# EAGLE design p0b-002 (EAGLE 9.6.2)
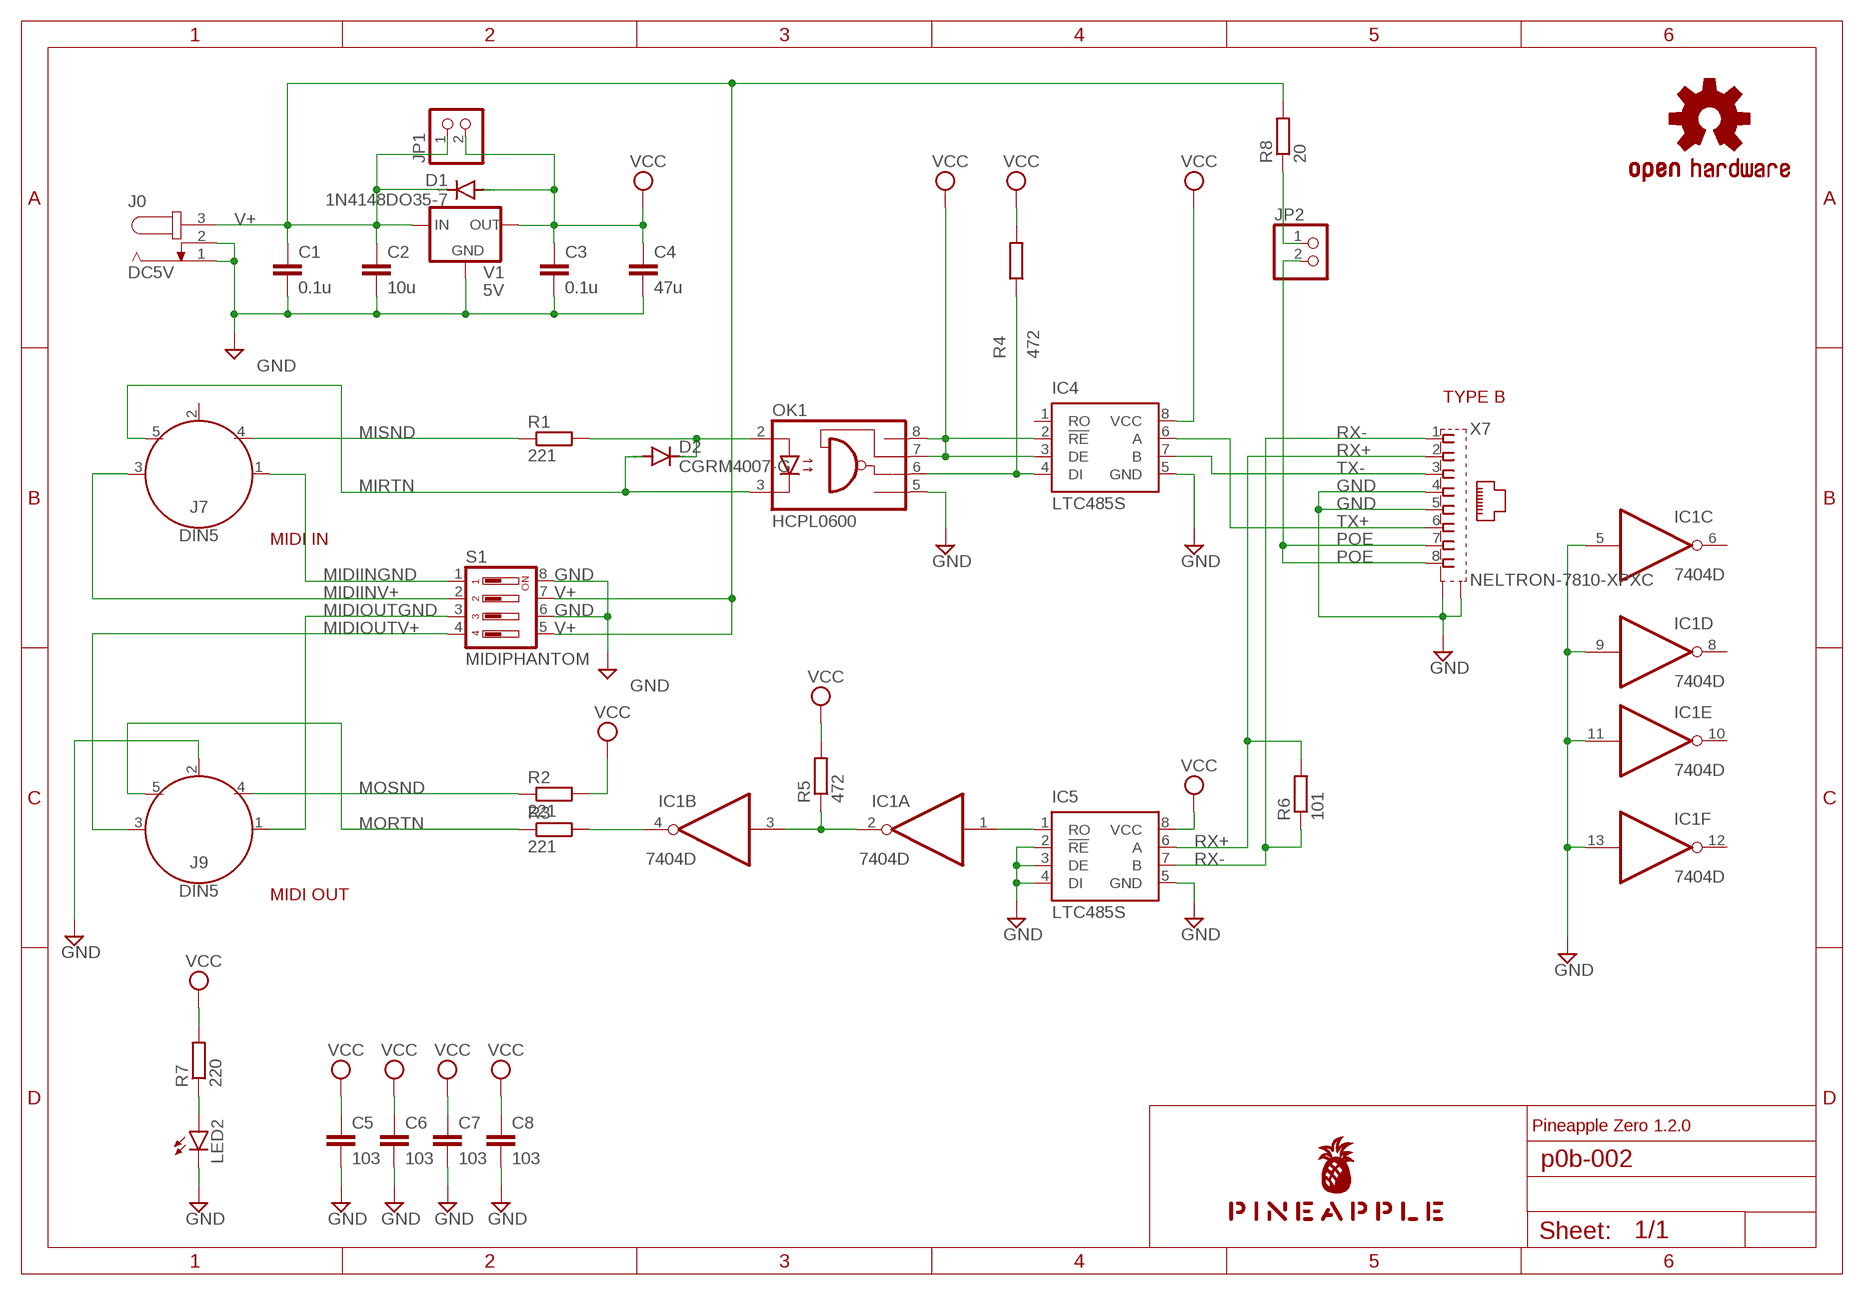
[diagram p0: schematic, sheet 1]

## Parts
C1  0.1u  C-EU025-025X050  [C025-025X050]
C2  10u  C-EU025-030X050  [C025-030X050]
C3  0.1u  C-EU025-025X050  [C025-025X050]
C4  47u  C-EU025-050X050  [C025-050X050]
C5  103  C-EUC1206  [C1206]
C6  103  C-EUC1206  [C1206]
C7  103  C-EUC1206  [C1206]
C8  103  C-EUC1206  [C1206]
D1  1N4148DO35-7  [DO35-7]
D2  CGRM4007-G  [SOD-123_MINI-SMA]
IC1  7404D  [SO14]
IC4  LTC485S  [SOIC8]
IC5  LTC485S  [SOIC8]
J0  DC5V  JACK-PLUG0  [SPC4077]
J7  DIN5  [DIN5-RA-PTH]
J9  DIN5  [DIN5-RA-PTH]
JP1  PINHD-1X2  [1X02]
JP2  PINHD-1X2  [1X02]
LED2  LEDCHIPLED_1206  [CHIPLED_1206]
LOGO1  OSHW-LOGOS-COPPER  [OSHW-LOGO-S_COPPER]
OK1  HCPL0600  [SOIC08]
R1  221  R-EU_M2012  [M2012]
R2  221  R-EU_M2012  [M2012]
R3  221  R-EU_M2012  [M2012]
R4  472  R-EU_M2012  [M2012]
R5  472  R-EU_M2012  [M2012]
R6  101  R-EU_M2012  [M2012]
R7  220  R-EU_M2012  [M2012]
R8  20  R-EU_M2012  [M2012]
S1  MIDIPHANTOM  DIP04YL  [DIP04YL]
U$1  PINEAPPLE450  [PINEAPPLE450]
V1  5V  78XXS  [78XXS]
X7  NELTRON-7810-XPXC  [NELTRON-7810-XPXC-FOOTPRINT]

## Nets
GND [gnd]: C1.2 C2.2 C3.2 C4.2 C5.2 C6.2 C7.2 C8.2 IC1.5(C:I) IC1.9(D:I) IC1.11(E:I) IC1.13(F:I) IC4.5(GND) IC5.2(!RE) IC5.3(DE) IC5.4(DI) IC5.5(GND) J0.1 J0.2 J9.2 LED2.C OK1.5(GND) S1.6 S1.8 V1.GND X7.4 X7.5 X7.S1 X7.S2
MIDIIN: D2.C OK1.2(A) R1.2
MIDIINGND [gnd]: J7.1 S1.1
MIDIINV+ [pwr]: J7.3 S1.2
MIDIOUT: IC1.4(B:O) R3.2
MIDIOUTGND [gnd]: J9.1 S1.3
MIDIOUTV+ [pwr]: J9.3 S1.4
MIRTN: D2.A J7.5 OK1.3(C)
MISND: J7.4 R1.1
MORTN: J9.5 R3.1
MOSND: J9.4 R2.1
N$4: LED2.A R7.1
NMIDIOUT: IC1.2(A:O) IC1.3(B:I) R5.1
POE [pwr]: JP2.2 X7.7 X7.8
POERAW [pwr]: JP2.1 R8.1
RX: IC1.1(A:I) IC5.1(RO)
RX+: IC5.6(A) R6.2 X7.2
RX-: IC5.7(B) R6.1 X7.1
TX: IC4.4(DI) OK1.6(VO) R4.1
TX+: IC4.6(A) X7.6
TX-: IC4.7(B) X7.3
V+ [pwr]: C1.1 C2.1 D1.C J0.3 JP1.1 R8.2 S1.5 S1.7 V1.IN
VCC [pwr]: C3.1 C4.1 C5.1 C6.1 C7.1 C8.1 D1.A IC4.2(!RE) IC4.3(DE) IC4.8(VCC) IC5.8(VCC) JP1.2 OK1.7(VE) OK1.8(VCC) R2.2 R4.2 R5.2 R7.2 V1.OUT
Unconnected: IC1.6(C:O) IC1.8(D:O) IC1.10(E:O) IC1.12(F:O) IC4.1(RO) J7.2

## Notes on the sheet
- TYPE B
- MIDI IN
- MIDI OUT
- Pineapple Zero 1.2.0

## Power pins joined to a net without a drawn wire
GND: IC1.7(P:GND)
VCC: IC1.14(P:VCC)

## Library data of the parts
C1-C8 = rcl:C-EU: CAPACITOR, European symbol; SPICEPREFIX: C
D1 = diode:1N4148: DIODE high speed (Philips)
D2 = diode:CGRM400*-G: Molded plasitc,JEDEC SOD-123/Mini SMA Source: Comchip CGRM4001-G.pdf
IC1 = 74xx-us:74*04: Hex INVERTER
IC4 IC5 = linear-technology:LTC485: Low Power RS485 Interface Transceiver Source: http://www.linear.com/pc/downloadDocument.do?navId=H0,C1,C1007,C1017,P2064,D1718; OC_FARNELL: unknown; OC_NEWARK: unknown
J0 = con-jack:JACK-PLUG: DC POWER JACK Power Jack, DC, Right Angle, Through Hole, Rated 5A at 16VDC, PC Terminals Distributor: Farnell (www.Farnell.de) Drawing: 84N1161.pdf / 84N1162.pdf Manufacturer: SPC Technology (www.spctechnology.com) Type: SPC4077 / SPC 4078; OC_FARNELL: unknown; OC_NEWARK: unknown
J7 J9 = SparkFun-Connectors:DIN5: DIN5 Connector - Female Right Angle (frequently used as a MIDI Jack connector) This type of connector and cable is frequently used for transmitting midi data (musical instrument digital interface). It is what you usually see on a keyboard or set of electronic drums. Learn more here <https://en.wikipedia.org/wiki/MIDI>. For more information on the pinout and electrical specifications of MIDI communications, please see the following resource: https://www.midi.org/specifications/item/midi-din-electrical-specification Here is the connector we sell at SparkFun: MIDI Connector - Female Right Angle <https://www.sparkfun.com/products/9536> (PRT-09536) Datasheet <hhttp://www.sparkfun.com/datasheets/Prototyping/Connectors/MIDI-RA.pdf> It is used on this SparkFun product: SparkFun MIDI Shield <https://www.sparkfun.com/products/12898> (DEV-12898); PROD_ID: CONN-09481
JP1 JP2 = pinhead:PINHD-1X2: PIN HEADER
LED2 = led:LED: LED OSRAM: - CHIPLED LG R971, LG N971, LY N971, LG Q971, LY Q971, LO R971, LY R971 LH N974, LH R974 LS Q976, LO Q976, LY Q976 LO Q996 - Hyper CHIPLED LW Q18S LB Q993, LB Q99A, LB R99A - SideLED LS A670, LO A670, LY A670, LG A670, LP A670 LB A673, LV A673, LT A673, LW A673 LH A674 LY A675 LS A676, LA A676, LO A676, LY A676, LW A676 LS A679, LY A679, LG A679 - Hyper Micro SIDELED® LS Y876, LA Y876, LO Y876, LY Y876 LT Y87S - SmartLED LW L88C, LW L88S LB L89C, LB L89S, LG L890 LS L89K, LO L89K, LY L89K LS L896, LA L896, LO L896, LY L896 - TOPLED LS T670, LO T670, LY T670, LG T670, LP T670 LSG T670, LSP T670, LSY T670, LOP T670, LYG T670 LG T671, LOG T671, LSG T671 LB T673, LV T673, LT T673, LW T673 LH T674 LS T676, LA T676, LO T676, LY T676, LB T676, LH T676, LSB T676, LW T676 LB T67C, LV T67C, LT T67C, LS T67K, LO T67K, LY T67K, LW E67C LS E67B, LA E67B, LO E67B, LY E67B, LB E67C, LV E67C, LT E67C LW T67C LS T679, LY T679, LG T679 LS T770, LO T770, LY T770, LG T770, LP T770 LB T773, LV T773, LT T773, LW T773 LH T774 LS E675, LA E675, LY E675, LS T675 LS T776, LA T776, LO T776, LY T776, LB T776 LHGB T686 LT T68C, LB T68C - Hyper Mini TOPLED® LB M676 - Mini TOPLED Santana® LG M470 LS M47K, LO M47K, LY M47K Source: http://www.osram.convergy.de LUXEON: - LUMILED® LXK2-PW12-R00, LXK2-PW12-S00, LXK2-PW14-U00, LXK2-PW14-V00 LXK2-PM12-R00, LXK2-PM12-S00, LXK2-PM14-U00 LXK2-PE12-Q00, LXK2-PE12-R00, LXK2-PE12-S00, LXK2-PE14-T00, LXK2-PE14-U00 LXK2-PB12-K00, LXK2-PB12-L00, LXK2-PB12-M00, LXK2-PB14-N00, LXK2-PB14-P00, LXK2-PB14-Q00 LXK2-PR12-L00, LXK2-PR12-M00, LXK2-PR14-Q00, LXK2-PR14-R00 LXK2-PD12-Q00, LXK2-PD12-R00, LXK2-PD12-S00 LXK2-PH12-R00, LXK2-PH12-S00 LXK2-PL12-P00, LXK2-PL12-Q00, LXK2-PL12-R00 Source: www.luxeon.com KINGBRIGHT: KA-3528ASYC Source: www.kingbright.com
LOGO1 = SparkFun-Aesthetics:OSHW-LOGO: Open-Source Hardware (OSHW) Logo This logo indicates the piece of hardware it is found on incorporates a OSHW license and/or adheres to the definition of open source hardware found here: http://freedomdefined.org/OSHW
OK1 = optocoupler:HCPL0600: HEWLETT PACKARD OPTO COUPLER; MF: AGILENT TECHNOLOGIES; MPN: HCPL-0600-000E; OC_FARNELL: 9994696; OC_NEWARK: 88H7774
R1-R8 = rcl:R-EU_: RESISTOR, European symbol; SPICEPREFIX: R
S1 = switch-dil:DIP04YL: DIL/CODE SWITCH; OC_FARNELL: unknown; OC_NEWARK: unknown
U$1 = pineapple:PINEAPPLE450
V1 = v-reg:78XXS: VOLTAGE REGULATOR
X7 = con-rj45:NELTRON-7810-XPXC: Mod. Jack, Right Angle, 8 posiotion, 8 contatcs RJ45 Source: GLX-S-88M.pdf

## Net classes
0 default: width 0.152 mm, drill 0.152 mm, clearance 0.152 mm
1 pwr: width 0.305 mm, drill 0.152 mm, clearance 0.152 mm
2 gnd: width 0.305 mm, drill 0.152 mm, clearance 0.152 mm

## Board
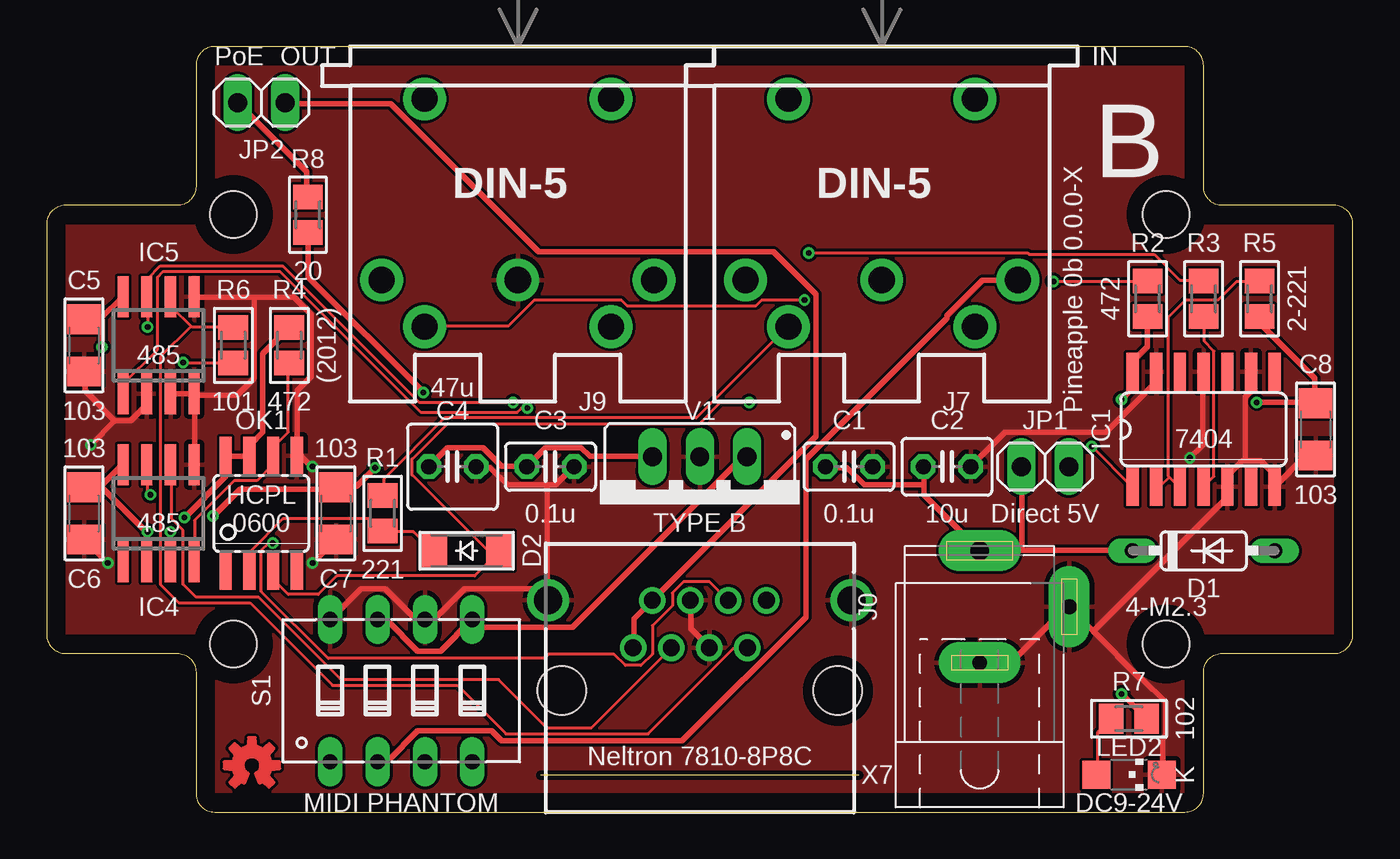
[diagram p1: board, top side]
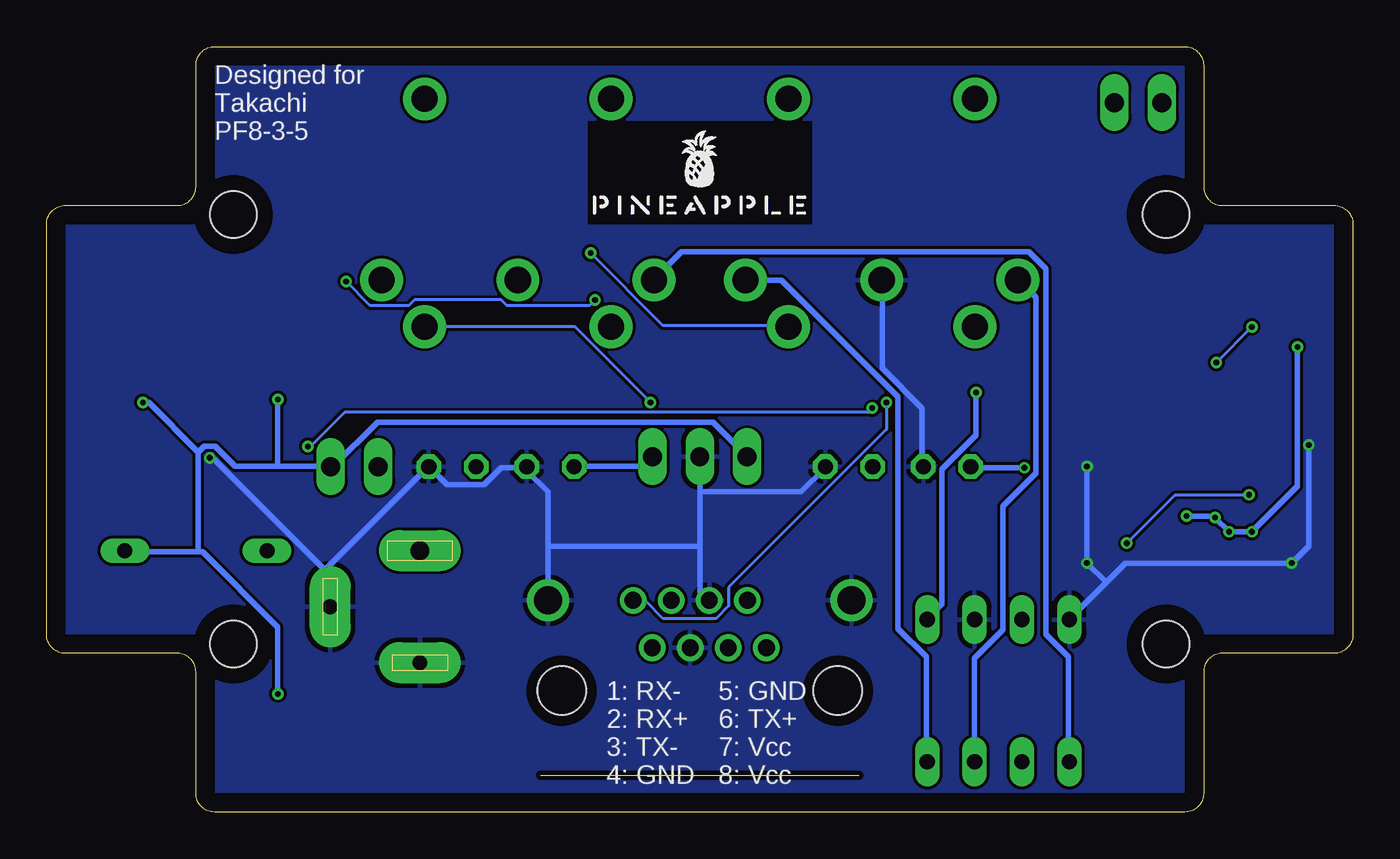
[diagram p2: board, bottom side, seen from below]

Size 70 x 41 mm. Coordinates in mm from the lower left corner, seen from the top.
Outline: 1,8.5 7,8.5 arc-90 8,7.5 8,1 arc90 9,0 61,0 arc90 62,1 62,7.5 arc-90 63,8.5 69,8.5 arc90 70,9.5 70,31.5 arc90 69,32.5 63,32.5 arc-90 62,33.5 62,40 arc90 61,41 9,41 arc90 8,40 8,33.5 arc-90 7,32.5 1,32.5 arc90 0,31.5 0,9.5 arc90 1,8.5
Copper layers (1*16): Top 0.035mm / dielectric 1.5mm / Bottom 0.035mm
Design rules "SeeedStudio_2layer_DRU_no_angle_20140221": minimum track width 6mil, minimum drill 12mil, track to track 6mil, track to pad 6mil, pad to pad 6mil, via to via 6mil, smd to smd 0mil, copper to edge 10mil, drill to drill 10mil, minimum pad ring 10mil, minimum via ring 6mil, stop-mask expansion 2mil, vias tented up to drill 100mil, thermal gap 10mil
Holes 2.5 mm at 10,9 60,9 60,32 10,32
tRestrict: area 0,8.5 to 1,32.5; area 0,31.5 to 9,32.5; area 8,31.5 to 9,41; area 8,40 to 62,41; area 61,31.5 to 62,41; area 61,31.5 to 70,32.5; area 69,8.5 to 70,32.5; area 61,8.5 to 70,9.5; area 61,0 to 62,9.5; area 8,0 to 62,1; area 8,0 to 9,9.5; area 0,8.5 to 9,9.5; 4 more areas
bRestrict: area 8,40 to 62,41; area 69,8.5 to 70,32.5; area 8,0 to 62,1; area 0,8.5 to 1,32.5; area 8,7 to 12,11; area 8,31.5 to 9,41; area 61,31.5 to 62,41; area 8,0 to 9,9.5; area 61,0 to 62,9.5; area 0,31.5 to 9,32.5; area 0,8.5 to 9,9.5; area 61,8.5 to 70,9.5; 5 more areas

### Footprints (pad centres in the part's own frame; a part is rotated, then mirrored left to right if it is on the bottom)
C025-025X050 = drill 0.813 octagon: 1 -1.27,0; 2 1.27,0
C025-030X050 = drill 0.813 octagon: 1 -1.27,0; 2 1.27,0
C025-050X050 = drill 0.813 octagon: 1 -1.27,0; 2 1.27,0
C1206 = smd 1.6 x 1.8: 1 -1.4,0; 2 1.4,0
DO35-7 = drill 0.813 long: A 3.81,0; C -3.81,0
SOD-123_MINI-SMA = smd 1.5 x 2.1: A 1.8,0; C -1.8,0
SO14 = smd 0.66 x 2.032: 1 -3.81,-3.073; 2 -2.54,-3.073; 3 -1.27,-3.073; 4 0,-3.073; 5 1.27,-3.073; 6 2.54,-3.073; 7 3.81,-3.073; 8 3.81,3.073; 9 2.54,3.073; 10 1.27,3.073; 11 0,3.073; 12 -1.27,3.073; 13 -2.54,3.073; 14 -3.81,3.073
SOIC8 = smd 0.6 x 2.2: 1 -1.905,-2.6; 2 -0.635,-2.6; 3 0.635,-2.6; 4 1.905,-2.6; 5 1.905,2.6; 6 0.635,2.6; 7 -0.635,2.6; 8 -1.905,2.6
SPC4077 = drill 0.8 pad 2.184 long: 1 -3,0; 2 0,-4.8 | drill 1 pad 2.184 long: 3 3,0
DIN5-RA-PTH = drill 1.4 pad 2.286: 1 7.3,12.5; 2 0,12.5; 3 -7.3,12.5; 4 5,15; 5 -5,15; 6 -5,2.8; 7 5,2.8
1X02 = drill 1.016 long: 1 -1.27,0; 2 1.27,0
CHIPLED_1206 = smd 1.5 x 1.5: A 0,-1.75; C 0,1.75
SOIC08 = smd 0.66 x 2.032: 1 -1.905,-3.073; 2 -0.635,-3.073; 3 0.635,-3.073; 4 1.905,-3.073; 5 1.905,3.073; 6 0.635,3.073; 7 -0.635,3.073; 8 -1.905,3.073
M2012 = smd 1.3 x 1.6: 1 -0.95,0; 2 0.95,0
DIP04YL = drill 0.813 long: 1 -3.81,-3.81; 2 -1.27,-3.81; 3 1.27,-3.81; 4 3.81,-3.81; 5 3.81,3.81; 6 1.27,3.81; 7 -1.27,3.81; 8 -3.81,3.81
78XXS = drill 1.016 long: GND 0,-2.54; IN -2.54,-2.54; OUT 2.54,-2.54
NELTRON-7810-XPXC-FOOTPRINT = drill 0.9 pad 1.422: 1 -3.57,-4.84; 2 -2.55,-2.3; 3 -1.53,-4.84; 4 -0.51,-2.3; 5 0.51,-4.84; 6 1.53,-2.3; 7 2.55,-4.84; 8 3.57,-2.3 | drill 1.5 pad 2.184: S1 -8.125,-4.84; S2 8.125,-4.84 | hole 2.6: -7.4,0; 7.4,0

### Placement (x,y rotation side)
C1  43,18.5 0 top
C2  48.25,18.5 0 top
C3  27,18.5 0 top
C4  21.75,18.5 0 top
C5  2,25 270 top
C6  2,16 270 top
C7  15.5,16 270 top
C8  68,20.5 270 top
D1  62,14 0 top
D2  22.5,14 0 top
IC1  62,20.5 0 top
IC4  6,16 0 top
IC5  6,25 0 top
J0  50,11 90 top
J7  44.75,41 180 top
J9  25.25,41 180 top
JP1  53.5,18.5 0 top
JP2  11.5,38 0 top
LED2  58,2 270 top
LOGO1  11,2.5 0 top
OK1  11.5,16 0 top
R1  18,16 270 top
R2  59,27.5 270 top
R3  62,27.5 270 top
R4  13,25 90 top
R5  65,27.5 270 top
R6  10,25 90 top
R7  58,5 0 top
R8  14,32 270 top
S1  19,6.5 0 top
U$1  35,32 0 bottom
V1  35,16.5 180 top
X7  35,6.5 180 top

### Tracks (layer width: path | path; a pad name or v marks a point on that pad's centre or on a via)
GND  (via drill 0.3)
  Top 0.305: C8.2 67.97,19.05 67.44,19.05 65.84,17.45 IC1.7 66.06,17.83 65.08,18.82 64.24,18.82 | 64.24,18.82 64.08,18.82 63.32,18.06 63.32,17.45 IC1.5 63.25,17.3 63.25,16.84 56.08,9.68 | 64.24,18.82 64.24,22.25 64.47,22.48 64.47,23.55 IC1.9 | 56.08,9.68 54.79,10.97 J0.2 54.63,10.97 51.66,8 50.06,8 J0.1 | 56.08,9.68 58.6,7.16 58.67,7.16 59.97,5.87 59.97,4.12 59.82,3.96 59.82,2.06 LED2.C | v61.27,18.97 61.95,19.66 61.95,23.55 IC1.11 | IC4.5 7.92,18.67 7.92,22.33 IC5.4 | IC5.3 6.71,22.4 7.77,22.4 IC5.4 | 11.12,27.58 7.92,27.58 IC5.5 | 11.12,27.58 13.26,27.58 14.17,26.67 14.17,23.32 13.41,22.55 13.41,19.13 OK1.5 13.56,19.13 14.17,18.52 v14.25,18.52 | 11.12,27.58 11.12,23.24 10.21,22.33 8.08,22.33 IC5.4 | 3.66,20.95 2.06,22.55 2.06,23.55 C5.2 | 3.66,20.95 4.5,20.95 5.33,21.79 5.33,22.33 IC5.2 | v3.28,13.34 2.06,14.55 C6.2 | v14.25,13.34 15.47,14.55 C7.2 | S1.8 15.24,10.36 16.84,11.96 18.14,11.96 19.74,10.36 20.27,10.36 S1.6 20.42,10.36 20.8,10.36 22.4,11.96 26.75,11.96 X7.S2 26.82,11.35 26.82,17.53 | v2.36,19.66 3.66,20.95 | IC1.13 59.44,23.55 59.44,23.01 56.77,20.34 51.36,20.34 49.53,18.52 C2.2 | X7.5 34.52,11.28 34.52,9.83 35.51,8.84 X7.4 | 26.82,17.53 27.28,17.53 28.19,18.44 C3.2 | 26.82,17.53 24.69,17.53 23.77,18.44 23.09,18.44 C4.2
  Bottom 0.305: v61.27,18.97 61.11,18.97 54.86,12.72 54.86,11.05 J0.2 55.02,13.03 49.61,18.44 C2.2 49.45,18.44 48.54,17.53 46.56,17.53 45.64,18.44 44.27,18.44 C1.2 44.27,18.29 43.13,17.14 43.13,14.25 | 13.22,12.31 15.16,10.36 S1.8 | 13.22,12.31 12.19,13.34 v3.28,13.34 2.36,14.25 v2.36,19.66 | 13.22,12.31 v14.25,13.34 v14.25,18.52 | 43.13,14.25 43.13,11.35 X7.S1 | 34.98,14.25 34.98,11.81 34.52,11.35 X7.5 | 34.98,14.25 34.98,17.14 | 34.98,17.14 34.98,18.97 V1.GND | J9.2 25.22,28.5 25.22,23.77 23.09,21.64 23.09,18.52 C4.2 | 34.98,17.14 29.57,17.14 28.27,18.44 C3.2 | 34.98,14.25 43.13,14.25
  pour Top: -2,-2 72,-2 72,42 -2,42
  pour Bottom: -4,-4 74,-4 74,44 -4,44
MIDIIN
  Top 0.152: D2.C 20.65,14.02 19.66,15.01 18.06,15.01 R1.2 17.98,15.09 17.37,15.7 12.65,15.7 10.9,13.95 10.9,12.95 OK1.2
MIDIINGND
  Bottom 0.305: S1.1 15.24,2.74 15.24,8.31 16.46,9.53 16.46,29.11 17.37,30.02 35.97,30.02 37.41,28.57 J7.1
MIDIINV+
  Top 0.305: S1.2 17.75,2.74 18.29,2.74 19.89,4.34 23.85,4.34 24.38,3.81 34.06,3.81 40.69,10.44 40.69,18.9 48.23,26.44 48.23,26.59 50.14,28.5 J7.3
MIDIOUT
  Top 0.152: R3.2 62.03,26.52 62.03,25.22 62.56,24.69 62.56,17.98 62.03,17.45 IC1.4
MIDIOUTGND
  Bottom 0.305: S1.3 20.27,2.74 20.27,8.23 18.75,9.75 18.75,16.38 16.99,18.14 16.99,27.58 17.91,28.5 J9.1
MIDIOUTV+
  Bottom 0.305: S1.4 22.86,2.74 22.86,8.31 24.38,9.83 24.38,22.25 30.63,28.5 32.54,28.5 J9.3
MIRTN  (via drill 0.3)
  Top 0.152: OK1.3 12.19,12.88 12.19,12.42 12.95,11.66 14.55,11.66 15.54,12.65 22.94,12.65 24.23,13.95 D2.A 23.93,13.72 19.58,18.06 19.58,18.9 21.49,20.8 34.98,20.8 36.12,21.95 v37.64,21.95
  Bottom 0.152: v37.64,21.95 41.68,25.98 49.68,25.98 J7.5
MISND
  Top 0.152: R1.1 18.06,16.99 18.06,17.83 21.34,21.11 34.82,21.11 39.7,25.98 J7.4
MORTN  (via drill 0.3)
  Top 0.152: v40.84,29.95 52.58,29.95 52.65,29.87 59.36,29.87 60.73,28.5 61.95,28.5 R3.1
  Bottom 0.152: v40.84,29.95 36.96,26.06 30.25,26.06 J9.5
MOSND  (via drill 0.3)
  Top 0.152: v53.95,28.42 58.98,28.42 R2.1 | v40.62,27.43 38.33,27.43 38.02,27.13 31.09,27.13 30.79,27.43 26.14,27.43 24.77,26.06 20.27,26.06 J9.4
  Bottom 0.152: v53.95,28.42 52.65,27.13 50.6,27.13 50.29,27.43 45.64,27.43 45.34,27.13 40.92,27.13 v40.62,27.43
N$4
  Top 0.152: LED2.A 56.31,2.06 56.31,4.27 57,4.95 R7.1
NMIDIOUT
  Top 0.152: 60.16,17.95 60.66,17.45 IC1.3 | 60.16,17.95 60.12,17.98 60.12,26.52 61.04,27.43 62.79,27.43 63.78,28.42 65,28.42 R5.1 | 60.16,17.95 59.66,17.45 59.51,17.45 IC1.2
POE
  Top 0.305: X7.8 31.47,8.84 31.47,10.36 32.38,11.28 X7.7 32.54,11.43 41.22,20.12 41.22,27.74 38.94,30.02 26.36,30.02 18.44,37.95 12.8,37.95 JP2.2
POERAW
  Top 0.305: R8.1 13.95,32.99 13.95,34.29 10.29,37.95 JP2.1
RX  (via drill 0.3)
  Top 0.152: v56.01,19.58 58.14,17.45 IC1.1 | v25.76,21.64 25.45,21.64 25.22,21.41 20.04,21.41 12.5,28.96 6.25,28.96 5.94,28.65 5.94,24.77 4.12,22.94 4.12,22.4 IC5.1
  Bottom 0.152: v56.01,19.58 55.85,19.58 54.03,21.41 25.98,21.41 v25.76,21.64
RX+
  Top 0.152: 7.73,26.02 6.71,27.05 6.71,27.58 IC5.6 | 7.73,26.02 7.77,25.98 9.98,25.98 R6.2 | 7.73,26.02 6.1,24.38 6.1,12.19 7.09,11.2 10.9,11.2 15.32,6.78 22.02,6.78 24.61,4.19 32.23,4.19 36.8,8.76 37.49,8.76 X7.2
RX-  (via drill 0.3)
  Top 0.152: v7.32,24.08 9.98,24.08 R6.1 | v5.41,25.98 5.41,27.58 IC5.7 5.41,27.66 5.41,28.57 6.1,29.26 12.65,29.26 19.96,21.95 v24.99,21.95
  Bottom 0.152: v5.41,25.98 v7.32,24.08 | v24.99,21.95 24.99,20.5 33.45,12.04 33.45,11.05 34.14,10.36 36.96,10.36 37.87,11.28 38.56,11.28 X7.1
TX
  Top 0.152: R4.1 12.95,24 12.95,20.34 12.19,19.58 12.19,19.13 OK1.6 12.12,19.05 12.12,18.59 11.28,17.75 10.06,17.75 7.92,15.62 7.92,13.41 IC4.4
TX+
  Top 0.152: IC4.6 6.71,18.59 6.71,15.7 7.32,15.09 7.32,12.19 8,11.51 11.35,11.51 15.77,7.09 24.23,7.09 26.82,4.5 29.18,4.5 33.45,8.76 X7.6
TX-  (via drill 0.3)
  Top 0.152: v5.56,16.99 5.41,17.14 5.41,18.59 IC4.7 | v12.12,14.4 11.89,14.4 11.51,14.02 11.51,11.81 15.09,8.23 26.67,8.23 26.9,8.46 30.4,8.46 31.01,7.85 31.85,7.85 32.46,8.46 32.46,9.98 33.53,11.05 33.53,11.73 34.14,12.34 35.51,12.34 36.5,11.35 X7.3
  Bottom 0.152: v5.56,16.99 9.53,16.99 v12.12,14.4
V+  (via drill 0.3)
  Top 0.305: 47.02,17.53 47.02,16.99 49.99,14.02 J0.3 50.14,14.02 52.27,14.02 | 47.02,17.53 47.02,18.44 C2.1 | 52.27,14.02 58.14,14.02 D1.C | 52.27,14.02 52.27,18.44 JP1.1 | 47.02,17.53 43.81,17.53 42.9,18.44 41.76,18.44 C1.1 | v20.19,22.48 14.02,28.65 14.02,31.01 R8.2 | S1.7 17.75,10.29 18.21,10.29 19.89,8.61 21.11,8.61 22.78,10.29 S1.5 22.94,10.29 23.32,9.91 28.19,9.91 37.26,18.97 37.49,18.97 V1.IN
  Bottom 0.305: C1.1 41.68,18.52 38.02,18.52 37.57,18.97 V1.IN | v20.19,22.48 20.19,20.19 22.02,18.36 22.02,11.12 22.78,10.36 S1.5
VCC  (via drill 0.3)
  Top 0.305: R5.2 65.08,26.52 65.08,26.14 67.97,23.24 67.97,21.95 C8.1 67.82,21.95 v64.85,21.95 | R2.2 58.98,26.52 58.98,24.92 58.22,24.16 58.22,23.62 IC1.14 58.06,23.47 58.06,22.55 v57.61,22.1 | v57.61,6.33 58.9,5.03 R7.2 | v17.6,18.44 16.61,17.45 15.54,17.45 C7.1 15.39,17.3 10.36,17.3 v8.91,15.85 | C4.1 20.5,18.52 21.49,19.51 23.39,19.51 24.38,18.52 25.68,18.52 C3.1 25.83,18.59 26.75,19.51 28.65,19.51 29.11,19.05 32.38,19.05 V1.OUT | R4.2 12.95,25.91 11.58,24.54 11.58,20.34 10.9,19.66 10.9,19.13 OK1.7 10.74,19.05 9.6,19.05 OK1.8 9.6,18.9 9.6,17.98 v7.39,15.77 | 2.9,26.44 2.06,26.44 C5.1 | 2.9,26.44 4.04,27.58 IC5.8 | 2.9,17.45 2.06,17.45 C6.1 | 2.9,17.45 4.04,18.59 IC4.8 | 5.33,15.01 5.33,13.41 IC4.2 | 2.9,17.45 5.33,15.01 | v6.63,15.01 IC4.3 | v5.41,15.01 5.33,15.01 | v2.97,24.92 2.97,26.36 2.9,26.44
  Bottom 0.305: v57.61,6.33 57.61,9.91 61.65,13.95 61.87,13.95 | 61.87,13.95 65.76,13.95 D1.A | 57.61,18.52 59.89,18.52 60.96,19.58 61.57,19.58 61.87,19.28 | 57.61,18.52 54.79,18.52 JP1.2 54.63,18.52 52.27,20.88 34.29,20.88 V1.OUT | 61.87,13.95 61.87,19.28 | 57.61,18.52 v57.61,22.1 | v64.85,21.95 64.54,21.95 61.87,19.28 | v17.6,18.44 20.42,18.44 C4.1 | v2.97,24.92 2.97,17.45 v5.41,15.01 v6.63,15.01 v7.39,15.77 7.47,15.85 v8.91,15.85

### Text on the board
tNames: PoE | OUT | IN | B | 20 | Pineapple 0b 0.0.0-X | 472 | 2-221 | (2012) | 485 | 47u | 103 | 101 | 472 | 103 | 103 | 7404 | HCPL | 103 | 485 | 0600 | 0.1u | TYPE B | 0.1u | 10u | Direct 5V | 221 | 4-M2.3 | 102 | Neltron 7810-8P8C | K | MIDI PHANTOM | DC9-24V
bNames: Designed for / Takachi / PF8-3-5 | 5: GND / 6: TX+ / 7: Vcc / 8: Vcc | 1: RX- / 2: RX+ / 3: TX- / 4: GND